# Altium project LCT M3.PrjPcb
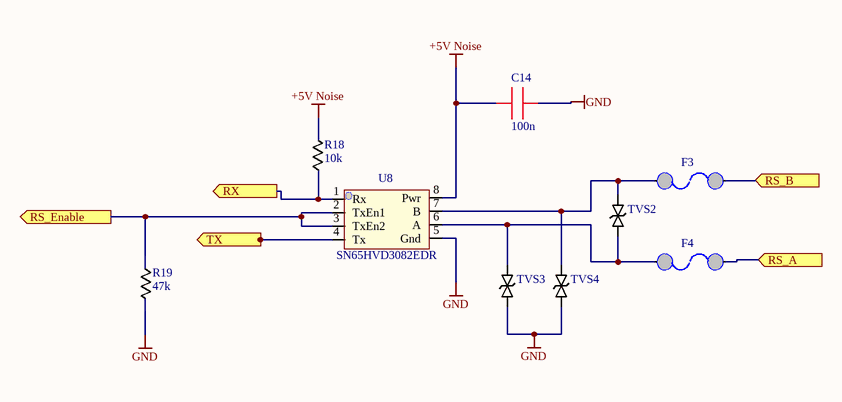
[diagram p0: RS485.SchDoc]
3 sheets, 57 parts. Net scope: flat (ports and power ports of the same name join across sheets).
Board file: LCT M3 PCB.PcbDoc
Sheets:
  RS485.SchDoc
  Encoder AFE.SchDoc
  Encoder AFE incremental.SchDoc

## Sheet RS485.SchDoc
size A3

### Parts
C14  100n  [0603]
F3  Resettable FUSE  [1210]  (value not drawn)
F4  Resettable FUSE  [1210]  (value not drawn)
R18  10k  [0603]
R19  47k  [0603]
TVS2  TVS Diode  [DO-214AC]  (value not drawn)
TVS3  TVS Diode  [DO-214AC]  (value not drawn)
TVS4  TVS Diode  [DO-214AC]  (value not drawn)
U8  SN65HVD3082EDR  [SOIC 8]

### Ports
RS_A, RS_B, RS_Enable, RX, TX

### Nets
+5V Noise: C14.1 R18.2 U8.8(Pwr)
GND: C14.2 R19.2 TVS3.1 TVS4.1 U8.5(Gnd)
NetF3_1: F3.1 ; port RS_B
NetF3_2: F3.2 TVS2.2 TVS4.2 U8.7(B)
NetF4_1: F4.1 ; port RS_A
NetF4_2: F4.2 TVS2.1 TVS3.2 U8.6(A)
NetR18_1: R18.1 U8.1(Rx) ; port RX
NetR19_1: R19.1 U8.2(TxEn1) U8.3(TxEn2) ; port RS_Enable
NetU8_4: U8.4(Tx) ; port TX

### Library data of the parts
C14 = 0603 CAP: CC0603KRX7R9BB104
F3 F4 = Fuse PTS: MF-USMF005-2
R18 = 0603 RES: RT0603FRE0710KL
R19 = 0603 RES: RC0603JR-0747K
TVS2-TVS4 = TVS: SMAJ6.0CA
U8 = MAX485

## Sheet Encoder AFE.SchDoc
size A4
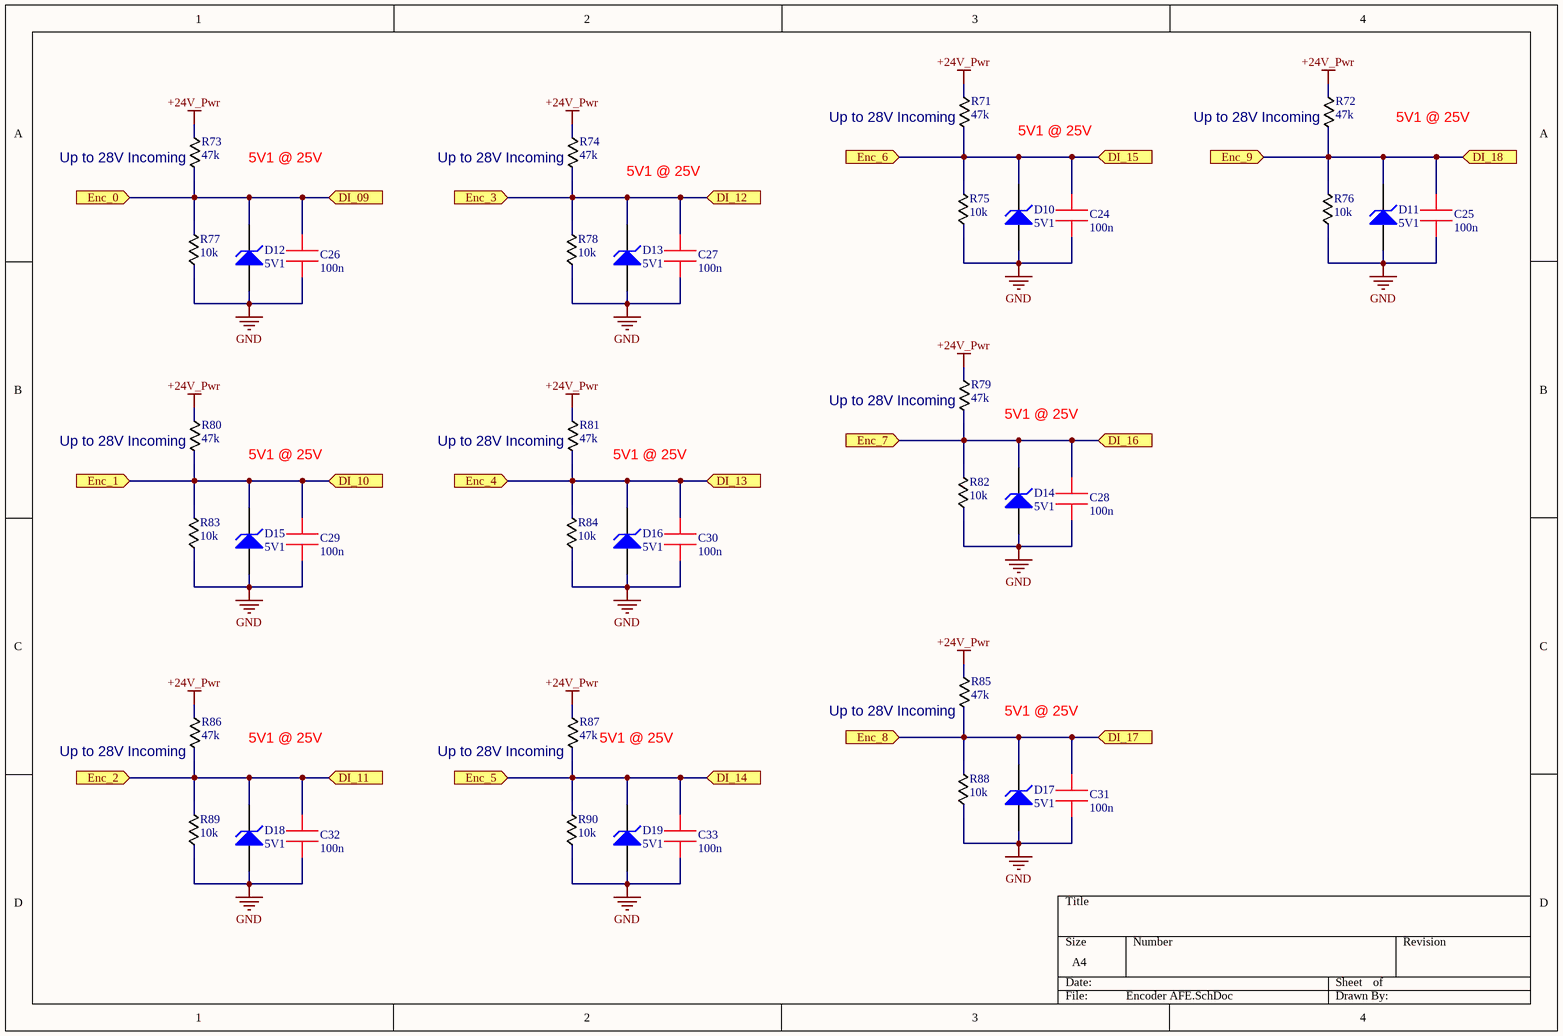
[diagram p1: Encoder AFE.SchDoc]

### Parts
C24  100n  [0603]
C25  100n  [0603]
C26  100n  [0603]
C27  100n  [0603]
C28  100n  [0603]
C29  100n  [0603]
C30  100n  [0603]
C31  100n  [0603]
C32  100n  [0603]
C33  100n  [0603]
D10  5V1  [SOT23]
D11  5V1  [SOT23]
D12  5V1  [SOT23]
D13  5V1  [SOT23]
D14  5V1  [SOT23]
D15  5V1  [SOT23]
D16  5V1  [SOT23]
D17  5V1  [SOT23]
D18  5V1  [SOT23]
D19  5V1  [SOT23]
R71  47k  [0603]
R72  47k  [0603]
R73  47k  [0603]
R74  47k  [0603]
R75  10k  [0603]
R76  10k  [0603]
R77  10k  [0603]
R78  10k  [0603]
R79  47k  [0603]
R80  47k  [0603]
R81  47k  [0603]
R82  10k  [0603]
R83  10k  [0603]
R84  10k  [0603]
R85  47k  [0603]
R86  47k  [0603]
R87  47k  [0603]
R88  10k  [0603]
R89  10k  [0603]
R90  10k  [0603]

### Ports
DI_09, DI_10, DI_11, DI_12, DI_13, DI_14, DI_15, DI_16, DI_17, DI_18, Enc_0, Enc_1, Enc_2, Enc_3, Enc_4, Enc_5, Enc_6, Enc_7, Enc_8, Enc_9

### Nets
+24V_Pwr: R71.1 R72.1 R73.1 R74.1 R79.1 R80.1 R81.1 R85.1 R86.1 R87.1
GND: C24.1 C25.1 C26.1 C27.1 C28.1 C29.1 C30.1 C31.1 C32.1 C33.1 D10.1(A) D11.1(A) D12.1(A) D13.1(A) D14.1(A) D15.1(A) D16.1(A) D17.1(A) D18.1(A) D19.1(A) R75.1 R76.1 R77.1 R78.1 R82.1 R83.1 R84.1 R88.1 R89.1 R90.1
NetC24_2: C24.2 D10.2(K) R71.2 R75.2 ; port DI_15, port Enc_6
NetC25_2: C25.2 D11.2(K) R72.2 R76.2 ; port DI_18, port Enc_9
NetC26_2: C26.2 D12.2(K) R73.2 R77.2 ; port DI_09, port Enc_0
NetC27_2: C27.2 D13.2(K) R74.2 R78.2 ; port DI_12, port Enc_3
NetC28_2: C28.2 D14.2(K) R79.2 R82.2 ; port DI_16, port Enc_7
NetC29_2: C29.2 D15.2(K) R80.2 R83.2 ; port DI_10, port Enc_1
NetC30_2: C30.2 D16.2(K) R81.2 R84.2 ; port DI_13, port Enc_4
NetC31_2: C31.2 D17.2(K) R85.2 R88.2 ; port DI_17, port Enc_8
NetC32_2: C32.2 D18.2(K) R86.2 R89.2 ; port DI_11, port Enc_2
NetC33_2: C33.2 D19.2(K) R87.2 R90.2 ; port DI_14, port Enc_5

### Notes on the sheet
- (near R73) Up to 28V Incoming
- 5V1 @ 25V
- (near R74) Up to 28V Incoming
- (near R71) Up to 28V Incoming
- (near R72) Up to 28V Incoming
- (near R80) Up to 28V Incoming
- (near R81) Up to 28V Incoming
- (near R79) Up to 28V Incoming
- (near R79) 5V1 @ 25V
- (near R81) 5V1 @ 25V
- (near R85) Up to 28V Incoming
- (near R85) 5V1 @ 25V
- (near R86) Up to 28V Incoming
- (near R87) Up to 28V Incoming
- (near R87) 5V1 @ 25V

### Library data of the parts
C24-C33 = 0603 CAP: CC0603KRX7R9BB104
D10-D19 = D Zener: BZX84C5V1LT1G
R71-R74 R79-R81 R85-R87 = 0603 RES: RC0603JR-0747K
R75-R78 R82-R84 R88-R90 = 0603 RES: RT0603FRE0710KL

## Sheet Encoder AFE incremental.SchDoc
size A4
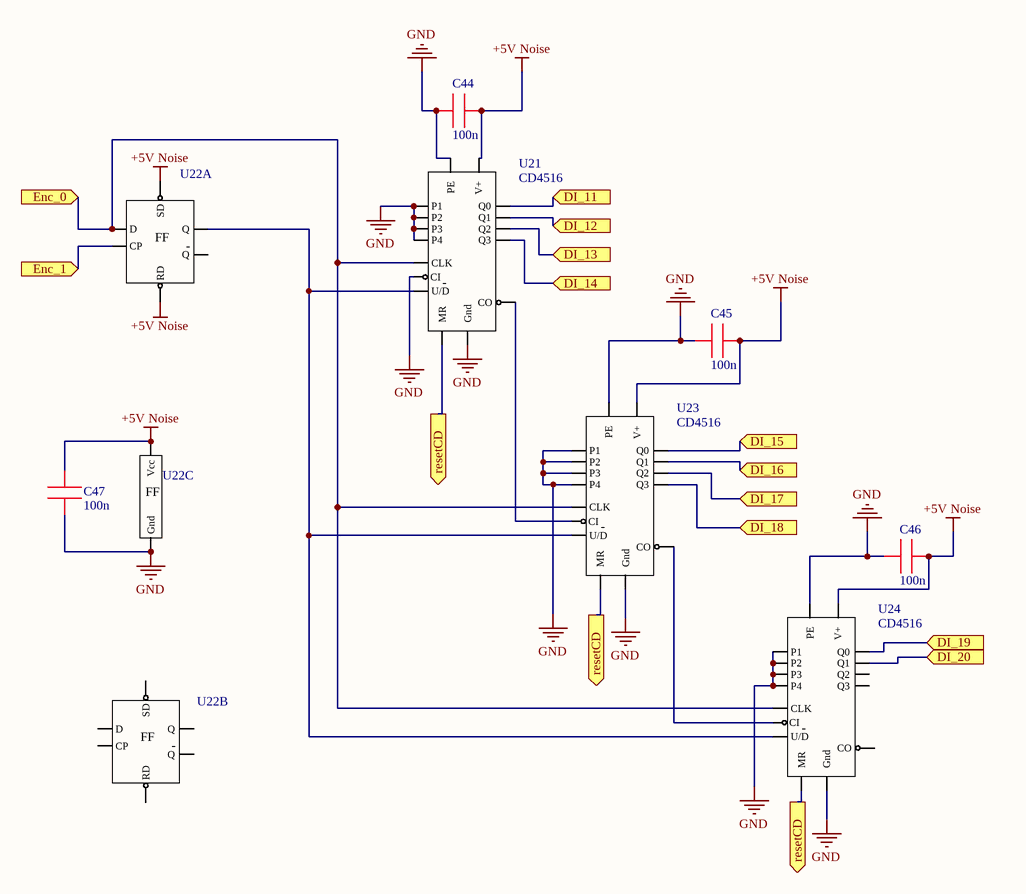
[diagram p2: Encoder AFE incremental.SchDoc]

### Parts
C44  100n  [0603]
C45  100n  [0603]
C46  100n  [0603]
C47  100n  [0603]
U21  CD4516  [TSSOP-16]
U22  74HC74D  [SOIC 14 lead]  (value not drawn)  (parts A,B,C of 3)
U23  CD4516  [TSSOP-16]
U24  CD4516  [TSSOP-16]

### Ports
DI_11, DI_12, DI_13, DI_14, DI_15, DI_16, DI_17, DI_18, DI_19, DI_20, Enc_0, Enc_1, resetCD

### Nets
+5V Noise: C44.2 C45.2 C46.2 C47.2 U21.16(V+) U22.1(RD) U22.4(SD) U22.14(Vcc) U23.16(V+) U24.16(V+)
GND: C44.1 C45.1 C46.1 C47.1 U21.1(PE) U21.3(P4) U21.4(P1) U21.5(CI) U21.8(Gnd) U21.12(P2) U21.13(P3) U22.7(Gnd) U23.1(PE) U23.3(P4) U23.4(P1) U23.8(Gnd) U23.12(P2) U23.13(P3) U24.1(PE) U24.3(P4) U24.4(P1) U24.8(Gnd) U24.12(P2) U24.13(P3)
NetC24_2: U23.6(Q0) ; port DI_15
NetC25_2: U23.2(Q3) ; port DI_18
NetC26_2: U21.15(CLK) U22.2(D) U23.15(CLK) U24.15(CLK) ; port Enc_0
NetC27_2: U21.11(Q1) ; port DI_12
NetC28_2: U23.11(Q1) ; port DI_16
NetC29_2: U22.3(CP) ; port Enc_1
NetC30_2: U21.14(Q2) ; port DI_13
NetC31_2: U23.14(Q2) ; port DI_17
NetC32_2: U21.6(Q0) ; port DI_11
NetC33_2: U21.2(Q3) ; port DI_14
NetU21_7: U21.7(CO) U23.5(CI)
NetU21_9: U21.9(MR) U23.9(MR) U24.9(MR) ; port resetCD
NetU21_10: U21.10(U/D) U22.5(Q) U23.10(U/D) U24.10(U/D)
NetU23_7: U23.7(CO) U24.5(CI)
NetU24_6: U24.6(Q0) ; port DI_19
NetU24_11: U24.11(Q1) ; port DI_20

Not connected (* = marked no-connect by the designer): U22 6(Q) 8(Q) 9(Q) 10(SD) 11(CP) 12(D) 13(RD); U24 2(Q3) 7(CO) 14(Q2)

### Notes on the sheet
- (in symbol 74HC74D, part A) FF; -
- (in symbol 74HC74D, part B) FF; -
- (in symbol 74HC74D, part C) FF
- (in symbol CD4516) -

### Library data of the parts
C44-C47 = 0603 CAP: CC0603KRX7R9BB104
U22 = 74HC74D: 74HC74D,653

## Nets that join several sheets
+5V Noise: RS485 (C14.1 R18.2 U8.8), Encoder AFE incremental (10 pins)
GND: RS485 (5 pins), Encoder AFE (30 pins), Encoder AFE incremental (24 pins)
NetC24_2: Encoder AFE (C24.2 D10.2 R71.2 R75.2), Encoder AFE incremental (U23.6)
NetC25_2: Encoder AFE (C25.2 D11.2 R72.2 R76.2), Encoder AFE incremental (U23.2)
NetC26_2: Encoder AFE (C26.2 D12.2 R73.2 R77.2), Encoder AFE incremental (U21.15 U22.2 U23.15 U24.15)
NetC27_2: Encoder AFE (C27.2 D13.2 R74.2 R78.2), Encoder AFE incremental (U21.11)
NetC28_2: Encoder AFE (C28.2 D14.2 R79.2 R82.2), Encoder AFE incremental (U23.11)
NetC29_2: Encoder AFE (C29.2 D15.2 R80.2 R83.2), Encoder AFE incremental (U22.3)
NetC30_2: Encoder AFE (C30.2 D16.2 R81.2 R84.2), Encoder AFE incremental (U21.14)
NetC31_2: Encoder AFE (C31.2 D17.2 R85.2 R88.2), Encoder AFE incremental (U23.14)
NetC32_2: Encoder AFE (C32.2 D18.2 R86.2 R89.2), Encoder AFE incremental (U21.6)
NetC33_2: Encoder AFE (C33.2 D19.2 R87.2 R90.2), Encoder AFE incremental (U21.2)